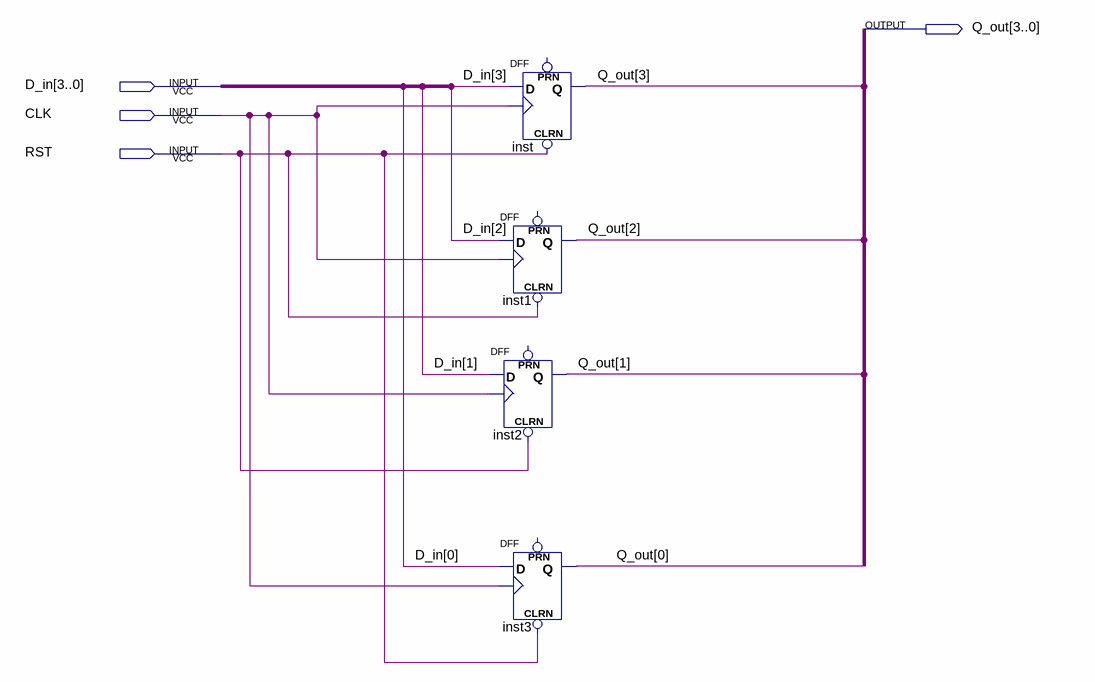
[diagram p0: schematic sheet]
// Quartus schematic REG4.bdf as structural Verilog: 4 symbols, 4 pins
module REG4 (
  input  [3:0] D_in,
  input  CLK,
  input  RST,
  output [3:0] Q_out
);

  DFF inst (.CLRN(RST), .CLK(CLK), .D(D_in[3]), .Q(Q_out[3]));  // open: PRN
  DFF inst1 (.CLRN(RST), .CLK(CLK), .D(D_in[2]), .Q(Q_out[2]));  // open: PRN
  DFF inst2 (.CLRN(RST), .CLK(CLK), .D(D_in[1]), .Q(Q_out[1]));  // open: PRN
  DFF inst3 (.CLRN(RST), .CLK(CLK), .D(D_in[0]), .Q(Q_out[0]));  // open: PRN
endmodule
